# EAGLE design Hello (EAGLE 6.2)
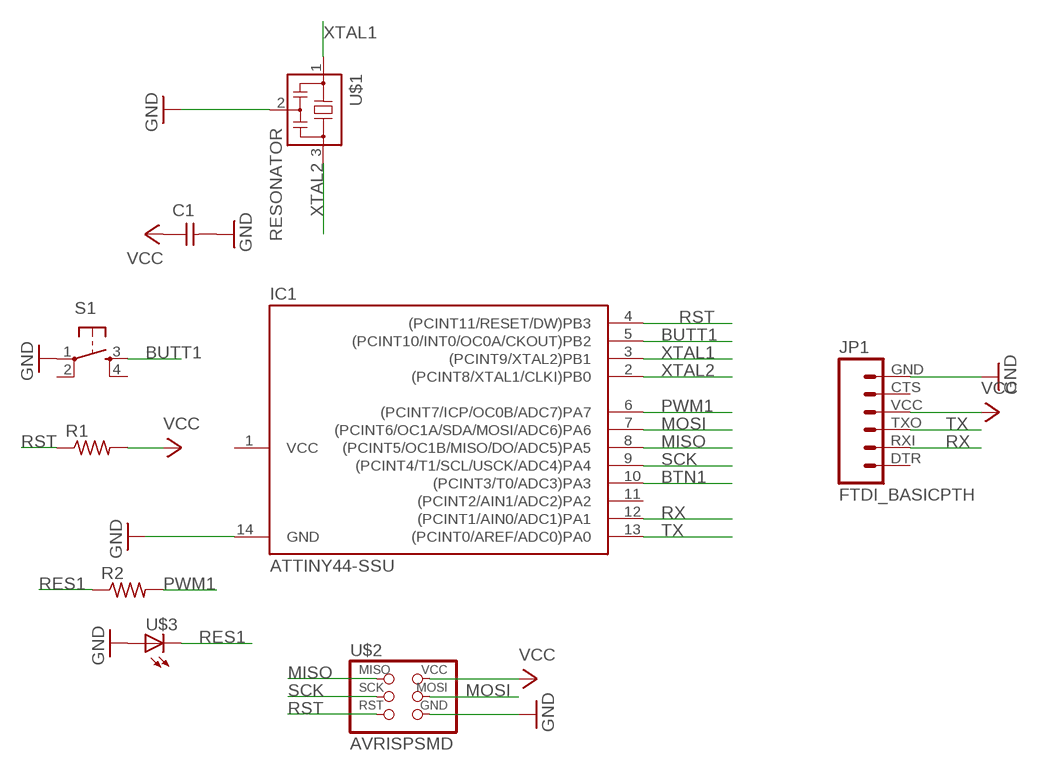
[diagram p0: schematic, sheet 1]

## Parts
C1  UNPOLARIZED_CAPACITOR1206  [1206]
IC1  ATTINY44-SSU  [SOIC14]
JP1  FTDI_BASICPTH  [FTDI_BASIC]
R1  RESISTOR1206  [1206]
R2  RESISTOR1206  [1206]
S1  6MM_SWITCH6MM_SWITCH  [6MM_SWITCH]
U$1  RESONATOR  [EFOBM]
U$2  AVRISPSMD  [2X03SMD]
U$3  LED1206  [1206]

## Nets
BTN1: IC1.10((PCINT3/T0/ADC3)PA3)
BUTT1: IC1.5((PCINT10/INT0/OC0A/CKOUT)PB2) S1.3(S)
GND: C1.2 IC1.14(GND) JP1.GND S1.1(P) U$1.2 U$2.6(GND) U$3.1(A)
MISO: IC1.8((PCINT5/OC1B/MISO/DO/ADC5)PA5) U$2.1(MISO)
MOSI: IC1.7((PCINT6/OC1A/SDA/MOSI/ADC6)PA6) U$2.4(MOSI)
PWM1: IC1.6((PCINT7/ICP/OC0B/ADC7)PA7) R2.2
RES1: R2.1 U$3.2(C)
RST: IC1.4((PCINT11/RESET/DW)PB3) R1.1 U$2.5(RST)
RX: IC1.12((PCINT1/AIN0/ADC1)PA1) JP1.RXI
SCK: IC1.9((PCINT4/T1/SCL/USCK/ADC4)PA4) U$2.3(SCK)
TX: IC1.13((PCINT0/AREF/ADC0)PA0) JP1.TXO
VCC: C1.1 JP1.VCC R1.2 U$2.2(VCC)
XTAL1: IC1.3((PCINT9/XTAL2)PB1) U$1.1
XTAL2: IC1.2((PCINT8/XTAL1/CLKI)PB0) U$1.3
Unconnected: IC1.11((PCINT2/AIN1/ADC2)PA2) JP1.CTS JP1.DTR S1.2(P1) S1.4(S1)

## Power pins joined to a net without a drawn wire
VCC: IC1.1(VCC)

## Library data of the parts
C1 = FAB_Hello:UNPOLARIZED_CAPACITOR: unpolarized_capacitor
IC1 = fab:ATTINY44
JP1 = SparkFun-Connectors:FTDI_BASIC: FTDI Basic header with labels
R1 R2 = FAB_Hello:RESISTOR
S1 = FAB_Hello:6MM_SWITCH: OMRON SWITCH
U$1 = fab:RESONATOR
U$2 = FAB_Hello:AVRISP
U$3 = FAB_Hello:LED

## Board
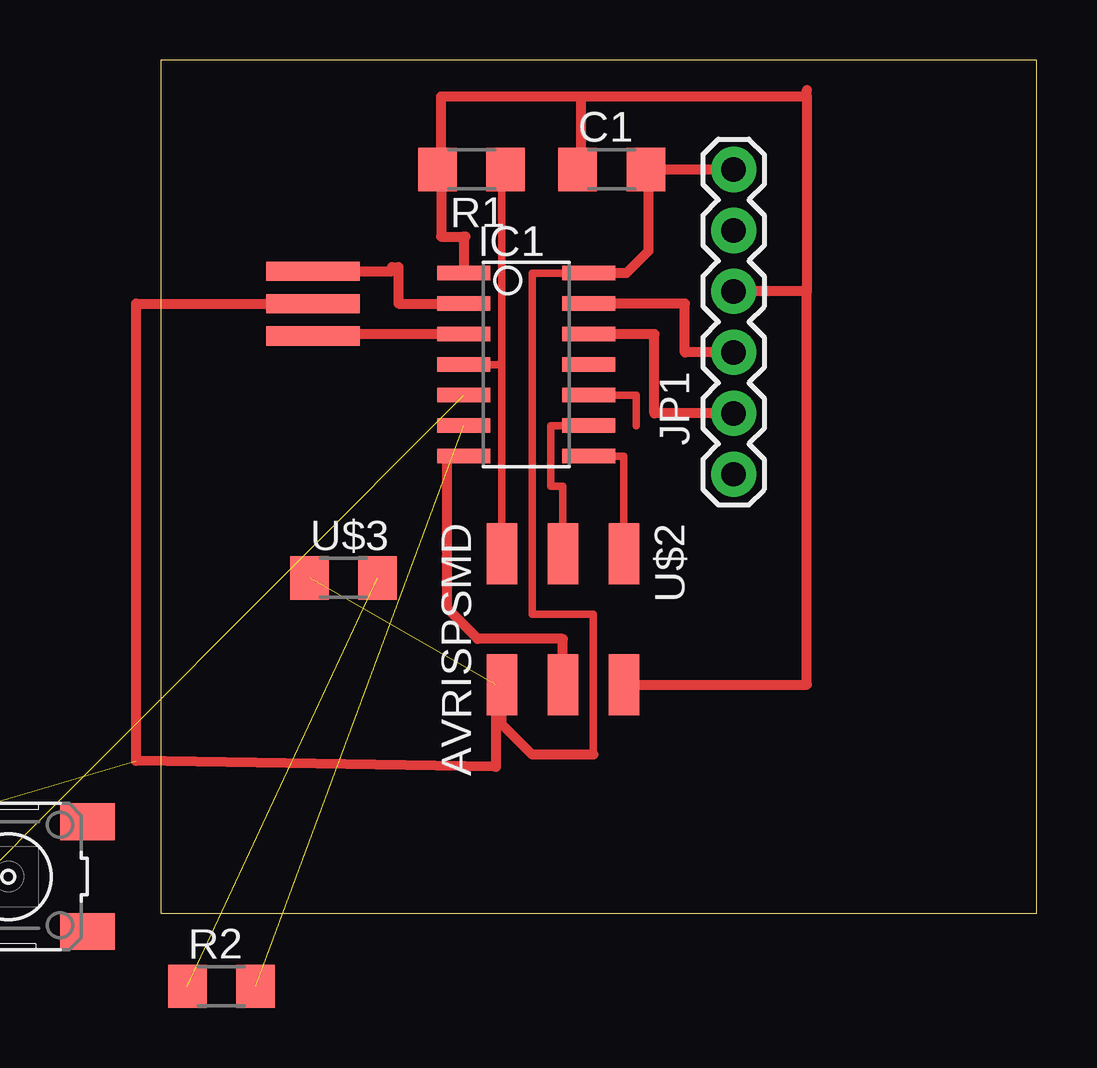
[diagram p1: board, top side]

Size 36.5 x 35.55 mm. Coordinates in mm from the lower left corner, seen from the top.
Outline: 0,0 36.5,0 36.5,35.55 0,35.55 0,0
Copper layers (1*16): Top 0.035mm / dielectric 1.5mm / Bottom 0.035mm
Design rules: minimum track width 10mil, minimum drill 24mil, track to track 8mil, track to pad 8mil, pad to pad 8mil, via to via 8mil, smd to smd 8mil, copper to edge 40mil, drill to drill 8mil, minimum pad ring 10mil, minimum via ring 8mil, stop-mask expansion 4mil, vias tented up to drill 0mil, thermal gap 10mil

### Footprints (pad centres in the part's own frame; a part is rotated, then mirrored left to right if it is on the bottom)
1206 = smd 1.6 x 1.803: 1 -1.422,0; 2 1.422,0
SOIC14 = smd 0.61 x 2.21: 1 -3.81,-2.603; 2 -2.54,-2.603; 3 -1.27,-2.603; 4 0,-2.603; 5 1.27,-2.603; 6 2.54,-2.603; 7 3.81,-2.603; 8 3.81,2.603; 9 2.54,2.603; 10 1.27,2.603; 11 0,2.603; 12 -1.27,2.603; 13 -2.54,2.603; 14 -3.81,2.603
FTDI_BASIC = drill 1.016 pad 1.88: CTS 10.16,0; DTR 0,0; GND 12.7,0; RXI 2.54,0; TXO 5.08,0; VCC 7.62,0
6MM_SWITCH = smd 2.286 x 1.524: 1 -3.302,2.286; 2 3.302,2.286; 3 -3.302,-2.286; 4 3.302,-2.286
EFOBM = smd 0.8 x 3.9: 1 -1.35,0; 2 0,0; 3 1.35,0
2X03SMD = smd 2.54 x 1.27: 1 -2.54,2.54; 2 2.92,2.54; 3 -2.54,0; 4 2.92,0; 5 -2.54,-2.54; 6 2.92,-2.54

### Placement (x,y rotation side)
C1  18.8,30.99 0 top
IC1  15.24,22.86 270 top
JP1  23.88,18.29 90 top
R1  12.95,30.99 180 top
R2  2.54,-3.05 0 top  (outside the outline)
S1  -6.35,1.52 0 top  (outside the outline)
U$1  6.35,25.4 90 top
U$2  16.76,12.45 270 top
U$3  7.62,13.97 0 top

### Tracks (layer width: path | path; a pad name or v marks a point on that pad's centre or on a via)
BTN1
  Top 0.305: IC1.10 19.81,21.59 19.81,20.32
BUTT1  (1 unrouted)
GND  (2 unrouted)
  Top 0.305: IC1.14 15.49,26.67 15.49,12.45 18.03,12.45 18.03,6.6
  Top 0.406: IC1.14 19.4,26.67 20.32,27.59 20.32,30.99 C1.2 JP1.GND | 18.03,6.6 15.49,6.6 14.22,7.87 U$2.6 13.97,9.53 13.97,6.1 -1.02,6.35 -1.02,25.4 U$1.2
MISO
  Top 0.305: IC1.8 19.3,19.05 U$2.1
MOSI
  Top 0.305: 11.94,19.05 IC1.7
  Top 0.406: U$2.4 16.76,11.43 13.21,11.43 11.94,12.7 11.94,19.05
PWM1  (1 unrouted)
RES1  (1 unrouted)
RST
  Top 0.305: IC1.4 14.22,22.86 | 14.22,22.86 U$2.5 | R1.1 14.22,30.99 14.22,22.86
RX
  Top 0.406: JP1.RXI 20.57,20.83 20.57,24.13 IC1.12
SCK
  Top 0.305: IC1.9 16.26,20.32 16.26,17.78 16.76,17.78 U$2.3
TX
  Top 0.406: JP1.TXO 21.84,23.37 21.84,25.4 IC1.13
VCC
  Top 0.406: U$2.2 26.92,9.53 26.92,25.91 | 26.92,25.91 JP1.VCC | C1.1 17.53,30.99 17.53,34.04 | 17.53,34.04 26.92,34.04 | 26.92,34.04 26.92,34.29 | 26.92,34.04 26.92,25.91 | R1.2 11.68,30.99 | 11.68,30.99 11.68,34.04 17.53,34.04 | 11.68,30.99 11.68,28.19 12.64,28.19 | 12.7,28.19 12.64,28.19 | 12.64,28.19 IC1.1
XTAL1
  Top 0.305: 6.35,24.13 U$1.1
  Top 0.406: IC1.3 6.35,24.13
XTAL2
  Top 0.406: U$1.3 9.65,26.75 9.65,26.92 9.91,26.92 9.91,25.4 IC1.2